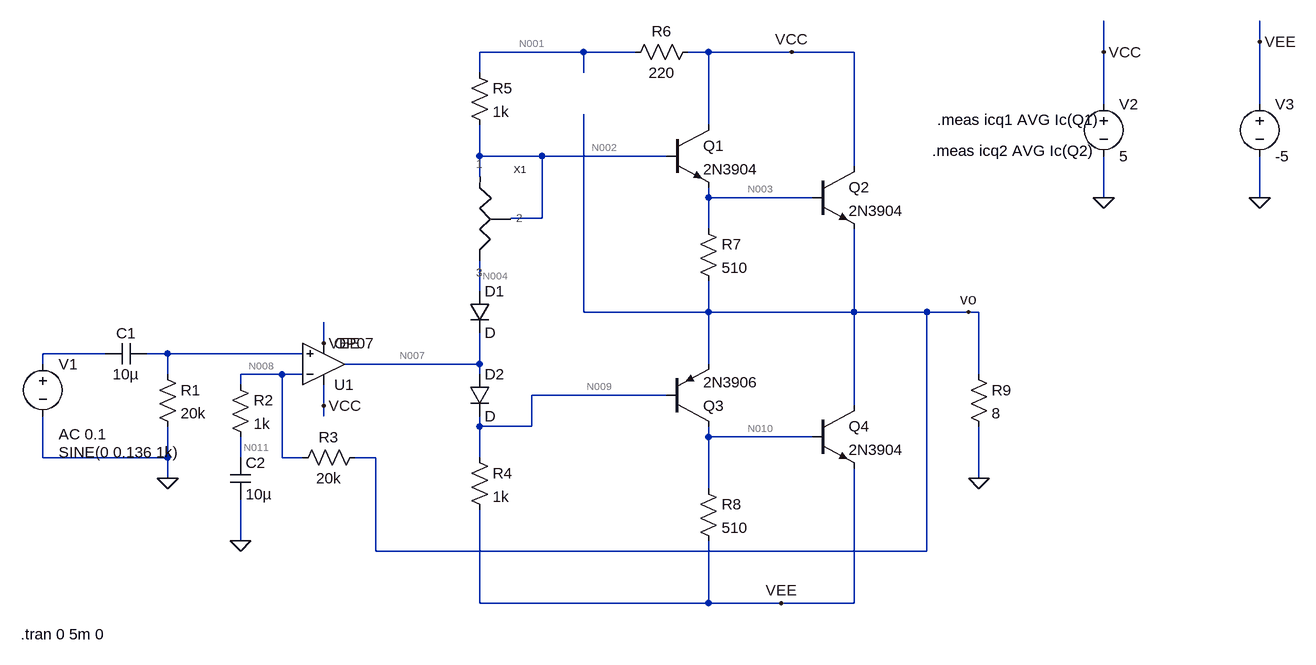
[diagram p0: schematic 2_24.asc]
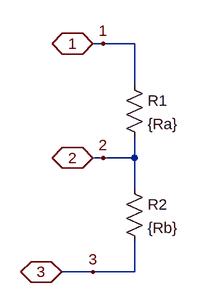
[diagram p1: sub-circuit dian_wei_qi.asc]
2_24.asc, the LTspice schematic file:
Version 4
SHEET 1 1432 784
WIRE 1376 -144 1376 -176
WIRE 336 -128 176 -128
WIRE 416 -128 336 -128
WIRE 528 -128 496 -128
WIRE 656 -128 528 -128
WIRE 752 -128 656 -128
WIRE 1136 -128 1136 -176
WIRE 176 -96 176 -128
WIRE 336 -96 336 -128
WIRE 1136 -48 1136 -128
WIRE 1376 -48 1376 -144
WIRE 528 -16 528 -128
WIRE 176 32 176 -16
WIRE 272 32 176 32
WIRE 464 32 272 32
WIRE 752 48 752 -128
WIRE 176 64 176 32
WIRE 528 96 528 80
WIRE 688 96 528 96
WIRE 1136 96 1136 32
WIRE 1376 96 1376 32
WIRE 272 128 272 32
WIRE 272 128 224 128
WIRE 528 144 528 96
WIRE 176 240 176 192
WIRE 336 272 336 -32
WIRE 528 272 528 224
WIRE 528 272 336 272
WIRE 752 272 752 144
WIRE 752 272 528 272
WIRE 864 272 752 272
WIRE 928 272 864 272
WIRE 944 272 928 272
WIRE -64 320 -64 288
WIRE -400 336 -496 336
WIRE -304 336 -336 336
WIRE -96 336 -304 336
WIRE -496 352 -496 336
WIRE 176 352 176 304
WIRE 176 352 -32 352
WIRE 528 352 528 272
WIRE -304 368 -304 336
WIRE -128 368 -192 368
WIRE -96 368 -128 368
WIRE 176 368 176 352
WIRE 944 368 944 272
WIRE -192 384 -192 368
WIRE 464 400 256 400
WIRE -64 416 -64 384
WIRE 752 416 752 272
WIRE -64 432 -64 416
WIRE 176 448 176 432
WIRE 256 448 256 400
WIRE 256 448 176 448
WIRE 528 464 528 448
WIRE 688 464 528 464
WIRE -496 496 -496 432
WIRE -304 496 -304 448
WIRE -304 496 -496 496
WIRE -192 496 -192 464
WIRE -128 496 -128 368
WIRE -96 496 -128 496
WIRE 16 496 -16 496
WIRE 176 496 176 448
WIRE -304 528 -304 496
WIRE 944 528 944 448
WIRE 528 544 528 464
WIRE -192 624 -192 560
WIRE 16 640 16 496
WIRE 864 640 864 272
WIRE 864 640 16 640
WIRE 176 720 176 576
WIRE 528 720 528 624
WIRE 528 720 176 720
WIRE 640 720 528 720
WIRE 752 720 752 512
WIRE 752 720 640 720
FLAG -192 624 0
FLAG -304 528 0
FLAG 944 528 0
FLAG 1136 96 0
FLAG 1376 96 0
FLAG 1136 -128 VCC
FLAG 656 -128 VCC
FLAG 1376 -144 VEE
FLAG 640 720 VEE
FLAG -64 416 VCC
FLAG -64 320 VEE
FLAG 928 272 vo
SYMBOL dian_wei_qi 160 128 R0
SYMATTR InstName X1
SYMATTR SpiceLine Ra=1000,Rb=0.1
SYMBOL OpAmps\\OP07 -64 416 M180
SYMATTR InstName U1
SYMBOL res -320 352 R0
SYMATTR InstName R1
SYMATTR Value 20k
SYMBOL cap -336 320 R90
WINDOW 0 0 32 VBottom 2
WINDOW 3 32 32 VTop 2
SYMATTR InstName C1
SYMATTR Value 10µ
SYMBOL res -208 368 R0
SYMATTR InstName R2
SYMATTR Value 1k
SYMBOL cap -208 496 R0
SYMATTR InstName C2
SYMATTR Value 10µ
SYMBOL res 0 480 R90
WINDOW 0 0 56 VBottom 2
WINDOW 3 32 56 VTop 2
SYMATTR InstName R3
SYMATTR Value 20k
SYMBOL diode 160 240 R0
SYMATTR InstName D1
SYMBOL diode 160 368 R0
SYMATTR InstName D2
SYMBOL res 160 480 R0
SYMATTR InstName R4
SYMATTR Value 1k
SYMBOL res 160 -112 R0
SYMATTR InstName R5
SYMATTR Value 1k
SYMBOL res 512 -144 R90
WINDOW 0 0 56 VBottom 2
WINDOW 3 32 56 VTop 2
SYMATTR InstName R6
SYMATTR Value 220
SYMBOL npn 464 -16 R0
SYMATTR InstName Q1
SYMATTR Value 2N3904
SYMBOL npn 688 48 R0
SYMATTR InstName Q2
SYMATTR Value 2N3904
SYMBOL res 512 128 R0
SYMATTR InstName R7
SYMATTR Value 510
SYMBOL npn 688 416 R0
SYMATTR InstName Q4
SYMATTR Value 2N3904
SYMBOL res 512 528 R0
SYMATTR InstName R8
SYMATTR Value 510
SYMBOL res 928 352 R0
SYMATTR InstName R9
SYMATTR Value 8
SYMBOL voltage -496 336 R0
WINDOW 3 24 152 Left 2
WINDOW 123 24 124 Left 2
WINDOW 39 0 0 Left 0
SYMATTR InstName V1
SYMATTR Value SINE(0 0.136 1k)
SYMATTR Value2 AC 0.1
SYMBOL voltage 1136 -64 R0
WINDOW 123 0 0 Left 0
WINDOW 39 0 0 Left 0
SYMATTR InstName V2
SYMATTR Value 5
SYMBOL voltage 1376 -64 R0
WINDOW 123 0 0 Left 0
WINDOW 39 0 0 Left 0
SYMATTR InstName V3
SYMATTR Value -5
SYMBOL pnp 464 448 M180
SYMATTR InstName Q3
SYMATTR Value 2N3906
TEXT 880 -24 Left 2 !.meas icq1 AVG Ic(Q1)
TEXT 872 24 Left 2 !.meas icq2 AVG Ic(Q2)
TEXT -530 768 Left 2 !.tran 0 5m 0

dian_wei_qi.asc, the sub-circuit schematic file:
Version 4
SHEET 1 880 680
WIRE 144 -32 128 -32
WIRE 192 -32 144 -32
WIRE 192 32 192 -32
WIRE 144 144 128 144
WIRE 192 144 192 112
WIRE 192 144 144 144
WIRE 192 192 192 144
WIRE 128 320 80 320
WIRE 192 320 192 272
WIRE 192 320 128 320
FLAG 144 -32 1
FLAG 144 144 2
FLAG 128 320 3
FLAG 128 -32 1
IOPIN 128 -32 BiDir
FLAG 128 144 2
IOPIN 128 144 BiDir
FLAG 80 320 3
IOPIN 80 320 BiDir
SYMBOL res 176 16 R0
SYMATTR InstName R1
SYMATTR Value {Ra}
SYMBOL res 176 176 R0
SYMATTR InstName R2
SYMATTR Value {Rb}

The netlist it stands for:
* 2_24.asc
XX1 N002 N002 N004 dian_wei_qi params: Ra=1000,Rb=0.1
XU1 N006 N008 VCC VEE N007 LT1001  ; OP07, pins In+ In- V+ V- OUT
R1 N006 0 20k
C1 N006 N005 10µ
R2 N008 N011 1k
C2 N011 0 10µ
R3 vo N008 20k
D1 N004 N007 D
D2 N007 N009 D
R4 N009 VEE 1k
R5 N001 N002 1k
R6 VCC N001 220
Q1 VCC N002 N003 0 2N3904
Q2 VCC N003 vo 0 2N3904
R7 N003 vo 510
Q4 vo N010 VEE 0 2N3904
R8 N010 VEE 510
R9 vo 0 8
V1 N005 0 SINE(0 0.136 1k) AC 0.1
V2 VCC 0 5
V3 VEE 0 -5
Q3 N010 N009 vo 0 2N3906

* block symbol definitions
.subckt dian_wei_qi 1 2 3
R1 1 2 {Ra}
R2 2 3 {Rb}
.ends dian_wei_qi

.model D D
.lib standard.dio
.model NPN NPN
.model PNP PNP
.lib standard.bjt
.meas icq1 AVG Ic(Q1)
.meas icq2 AVG Ic(Q2)
.tran 0 5m 0
.lib LTC.lib
.backanno
.end

* Results of the author's LTspice run, read from the files saved beside the schematic
* Operating Point, zero values left out:
*   V(n002) = 760.5 mV
*   V(n004) = 760.1 mV
*   V(n008) = -138.1 nV
*   V(vcc) = 5 V
*   V(vee) = -5 V
*   V(n007) = 72.78 mV
*   V(n011) = -138.1 nV
*   V(vo) = -138.2 nV
*   V(n009) = -620.5 mV
*   V(n001) = 4.235 V
*   V(n003) = 139.9 mV
*   V(n010) = -4.861 V
*   Ic(Q3) = -273 µA
*   Ib(Q3) = -1.31 µA
*   Ie(Q3) = 274.3 µA
*   Ic(Q4) = 7.146 pA
*   Ib(Q4) = -4.717 pA
*   Ie(Q4) = -2.434 pA
*   Ic(Q2) = 7.221 pA
*   Ib(Q2) = -4.715 pA
*   Ie(Q2) = -2.489 pA
*   Ic(Q1) = 273.4 µA
*   Ib(Q1) = 874.9 nA
*   Ie(Q1) = -274.3 µA
*   I(D2) = 4.378 mA
*   I(D1) = 3.474 mA
*   I(R9) = -17.27 nA
*   I(R8) = 273 µA
*   I(R7) = 274.3 µA
*   I(R6) = 3.475 mA
*   I(R5) = 3.475 mA
*   I(R4) = 4.379 mA
*   I(V3) = 6.473 mA
*   I(V2) = -6.473 mA
*   Ix(x1:2) = 3.474 mA
*   Ix(x1:3) = -3.474 mA
*   Ix(u1:3) = 2.725 mA
*   Ix(u1:4) = -1.821 mA
*   Ix(u1:5) = -904 µA
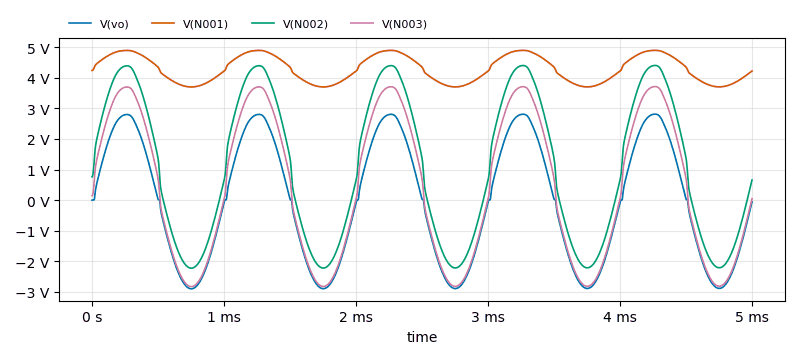
[diagram p2: Transient Analysis of 2_24.asc, plotted from the saved traces]
* Transient Analysis, 1 run:
*   V(vo): min -2.896 V, max 2.809 V, average -35.17 mV, rms 2.018 V, last -58.57 mV
*   V(N001): min 3.698 V, max 4.892 V, average 4.291 V, rms 4.313 V, last 4.217 V
*   V(N002): min -2.222 V, max 4.4 V, average 1.07 V, rms 2.639 V, last 659.1 mV
*   V(N003): min -2.825 V, max 3.709 V, average 426 mV, rms 2.414 V, last 46.08 mV
* From the log:
*   icq1: AVG(ic(q1))=0.0015004 FROM 0 TO 0.005
*   icq2: AVG(ic(q2))=0.109608 FROM 0 TO 0.005